# Altium schematic sheet IMU_Schematics.SchDoc: MPU9250 IMU Unit
size A4; DrawnBy: Hamed Damirchi; Organization: ARAS Robotics Group; Revision: 1.0; ProjectName: VIO_Camera_Module
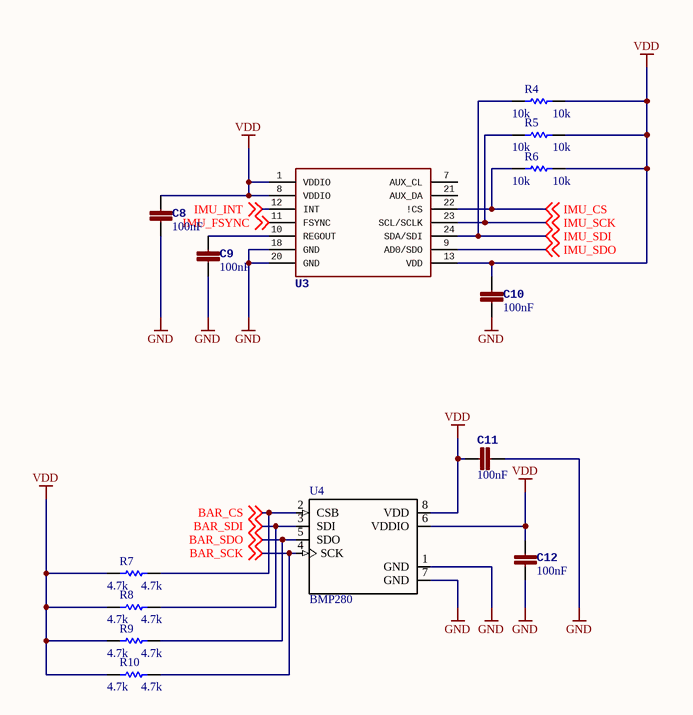
[diagram p0: IMU_Schematics.SchDoc]

## Parts
C8  value 100nF  [_0603]  (hidden comment: Cap)
C9  value 100nF  [_0603]  (hidden comment: Cap)
C10  value 100nF  [_0603]  (hidden comment: Cap)
C11  value 100nF  [_0603]  (hidden comment: Cap)
C12  value 100nF  [_0603]  (hidden comment: Cap)
R4  10k  [RES0603]
R5  10k  [RES0603]
R6  10k  [RES0603]
R7  4.7k  [RES0603]
R8  4.7k  [RES0603]
R9  4.7k  [RES0603]
R10  4.7k  [RES0603]
U3  MPU-9250  [_QFN-24-EP]  (value not drawn)
U4  BMP280  [*XDCR_BMP280]

## Nets
GND: C8.1 C9.1 C10.1 C11.2 C12.2 U3.18(GND) U3.20(GND) U4.1(GND) U4.7(GND)
VDD: C8.2 C10.2 C11.1 C12.1 R4.2 R5.2 R6.2 R7.1 R8.1 R9.1 R10.1 U3.1(VDDIO) U3.8(VDDIO) U3.13(VDD) U4.6(VDDIO) U4.8(VDD)
BAR_CS: R7.2 U4.2(CSB) ; off-sheet BAR_CS
BAR_SCK: R10.2 U4.4(SCK) ; off-sheet BAR_SCK
BAR_SDI: R8.2 U4.3(SDI) ; off-sheet BAR_SDI
BAR_SDO: R9.2 U4.5(SDO) ; off-sheet BAR_SDO
IMU_CS: R6.1 U3.22(!CS) ; off-sheet IMU_CS
IMU_FSYNC: U3.11(FSYNC) ; off-sheet IMU_FSYNC
IMU_INT: U3.12(INT) ; off-sheet IMU_INT
IMU_SCK: R5.1 U3.23(SCL/SCLK) ; off-sheet IMU_SCK
IMU_SDI: R4.1 U3.24(SDA/SDI) ; off-sheet IMU_SDI
IMU_SDO: U3.9(AD0/SDO) ; off-sheet IMU_SDO
NetC9_2: C9.2 U3.10(REGOUT)

Not connected (* = marked no-connect by the designer): U3 7(AUX_CL) 21(AUX_DA)

## Library data of the parts
C8-C12 = Cap_1
R4-R10 = RES SMD PACKAGE: TOTAL SMD RESISTOR PACK; Designer: Abbas Basereh; Desc.: RES SMD PAKAGES; Data: 2017-3-10
  R4-R6: VALUE: 10k
  R7-R10: VALUE: 4.7k
U3 = MPU-9250: PROD_ID: IC-13192
U4 = BMP280: BMP280 Absolute Barometric Pressure Sensor for Battery Powered Devices 2 x 2.5mm; MF: Bosch; MP: BMP280; Price: None; Availability: Unavailable; SnapEDA_Link: https://www.snapeda.com/parts/BMP280/Bosch%20Sensortec/view-part/?ref=snap; Package: SMD-8 Bosch Tools; Value: *